# Altium schematic sheet Connector_Power.SchDoc
size A4; PageSetup: Record=PageOptions|CenterHorizontal=True|CenterVertical=True|PrintScale=1.00|XCorrection=1.00|YCorrection=1.00|PrintKind=1|BorderSize=5000000|LeftOffset=0|BottomOffset=0|Orientation=2|PaperLength=1000|PaperWidth=1000|Scale=100|PaperSource=7|PrintQuality=-3|MediaType=1|DitherType=10|PrintScaleMode=1|PaperKind=A4|PaperIndex=9
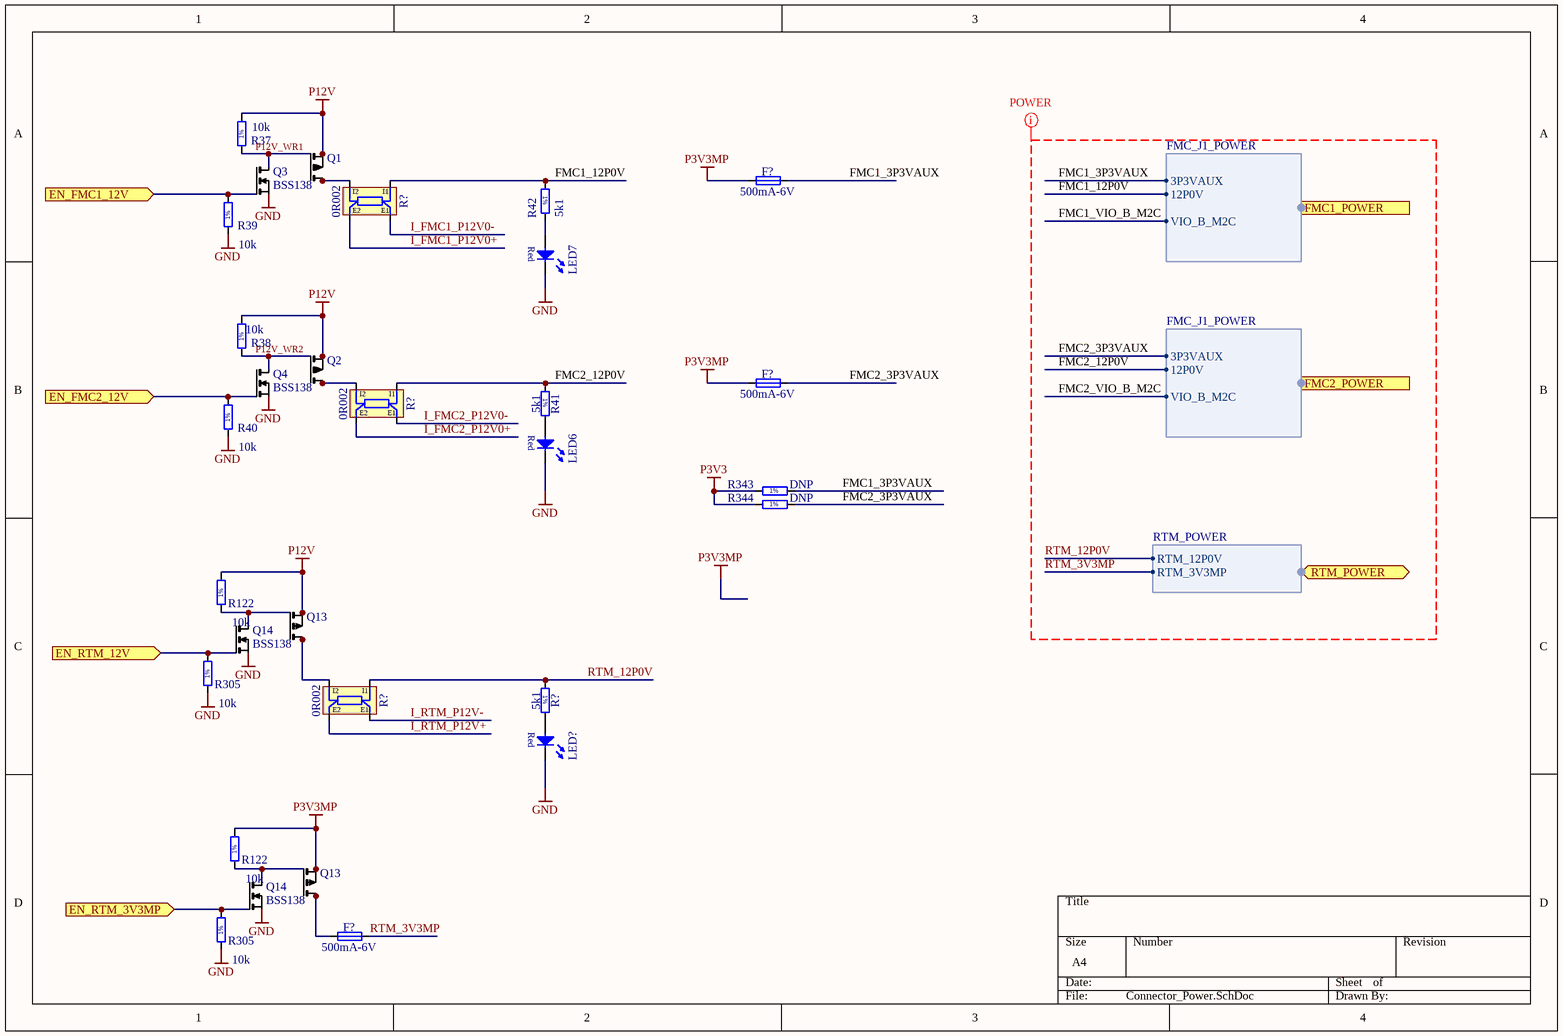
[diagram p0: Connector_Power.SchDoc]

## Parts
(Parts that share a designator on the sheet are numbered #1, #2 ... from top to bottom, then left to right.)
F?#1  500mA-6V  [FUSR_BOURNS_MF-PSMF050]
F?#2  500mA-6V  [FUSR_BOURNS_MF-PSMF050]
F?#3  500mA-6V  [FUSR_BOURNS_MF-PSMF050]
LED6  Red  [LED_AVAGO_HSMC-C150]  (value not drawn)
LED7  Red  [LED_AVAGO_HSMC-C150]  (value not drawn)
LED?  Red  [LED_AVAGO_HSMC-C150]  (value not drawn)
Q1  IRF9317PBF  or IRF9310PbF  [so-8]  (value not drawn)
Q2  IRF9317PBF  or IRF9310PbF  [so-8]  (value not drawn)
Q3  BSS138  [SOT95P251X112-3N]
Q4  BSS138  [SOT95P251X112-3N]
Q13#1  IRF9317PBF  or IRF9310PbF  [so-8]  (value not drawn)
Q13#2  IRF9317PBF  or IRF9310PbF  [so-8]  (value not drawn)
Q14#1  BSS138  [SOT95P251X112-3N]
Q14#2  BSS138  [SOT95P251X112-3N]
R37  10k  [RESC1005X40N]
R38  10k  [RESC1005X40N]
R39  10k  [RESC1005X40N]
R40  10k  [RESC1005X40N]
R41  5k1  [RESC1608X55N]
R42  5k1  [RESC1608X55N]
R122#1  10k  [RESC1005X40N]
R122#2  10k  [RESC1005X40N]
R305#1  10k  [RESC1005X40N]
R305#2  10k  [RESC1005X40N]
R343  DNP  [RESC1005X40N]
R344  DNP  [RESC1005X40N]
R?#1  0R002  [RES_VISHAY_WSL3637_0R002-0R01]
R?#2  0R002  [RES_VISHAY_WSL3637_0R002-0R01]
R?#3  5k1  [RESC1608X55N]
R?#4  0R002  [RES_VISHAY_WSL3637_0R002-0R01]

## Ports
EN_FMC1_12V (in), EN_FMC2_12V (in), EN_RTM_3V3MP (in), EN_RTM_12V (in), FMC1_POWER (harness FMC_J1_POWER), FMC2_POWER (harness FMC_J1_POWER), RTM_POWER (harness RTM_POWER)

## Harnesses
FMC_J1_POWER: 3P3VAUX, 12P0V, VIO_B_M2C
RTM_POWER: RTM_12P0V, RTM_3V3MP

## Nets
GND: LED6.1(C) LED7.1(C) LED?.1(C) Q3.2(S) Q4.2(S) Q14#1.2(S) Q14#2.2(S) R39.1 R40.1 R305#1.1 R305#2.1
P3V3: R343.1 R344.1
P3V3MP: F?#1.1 F?#2.1 Q13#2.1(S1) Q13#2.2(S1) Q13#2.3(S1) R122#2.2
P12V: Q1.1(S1) Q1.2(S1) Q1.3(S1) Q2.1(S1) Q2.2(S1) Q2.3(S1) Q13#1.1(S1) Q13#1.2(S1) Q13#1.3(S1) R37.2 R38.2 R122#1.2
EN_FMC1_12V: Q3.1(G) R39.2 ; port EN_FMC1_12V
EN_FMC2_12V: Q4.1(G) R40.2 ; port EN_FMC2_12V
EN_RTM_3V3MP: Q14#2.1(G) R305#2.2 ; port EN_RTM_3V3MP
EN_RTM_12V: Q14#1.1(G) R305#1.2 ; port EN_RTM_12V
FMC1_3P3VAUX: F?#1.2 R343.2 ; port FMC1_POWER.3P3VAUX
FMC1_12P0V: R42.1 R?#1.I1 ; port FMC1_POWER.12P0V
FMC1_VIO_B_M2C: port FMC1_POWER.VIO_B_M2C
FMC2_3P3VAUX: F?#2.2 R344.2 ; port FMC2_POWER.3P3VAUX
FMC2_12P0V: R41.1 R?#2.I1 ; port FMC2_POWER.12P0V
FMC2_VIO_B_M2C: port FMC2_POWER.VIO_B_M2C
I_FMC1_P12V0+: R?#1.E2
I_FMC1_P12V0-: R?#1.E1
I_FMC2_P12V0+: R?#2.E2
I_FMC2_P12V0-: R?#2.E1
I_RTM_P12V+: R?#4.E2
I_RTM_P12V-: R?#4.E1
P12V_WR1: Q1.4(G1) Q3.3(D) R37.1
P12V_WR2: Q2.4(G1) Q4.3(D) R38.1
RTM_3V3MP: F?#3.2 ; port RTM_POWER.RTM_3V3MP
RTM_12P0V: R?#3.1 R?#4.I1 ; port RTM_POWER.RTM_12P0V
NetF?#3_1: F?#3.1 Q13#2.5(D1) Q13#2.6(D1) Q13#2.7(D1) Q13#2.8(D1)
NetLED6_2: LED6.2(A) R41.2
NetLED7_2: LED7.2(A) R42.2
NetLED?_2: LED?.2(A) R?#3.2
NetQ1_5: Q1.5(D1) Q1.6(D1) Q1.7(D1) Q1.8(D1) R?#1.I2
NetQ2_5: Q2.5(D1) Q2.6(D1) Q2.7(D1) Q2.8(D1) R?#2.I2
NetQ13#1_4: Q13#1.4(G1) Q14#1.3(D) R122#1.1
NetQ13#1_5: Q13#1.5(D1) Q13#1.6(D1) Q13#1.7(D1) Q13#1.8(D1) R?#4.I2
NetQ13#2_4: Q13#2.4(G1) Q14#2.3(D) R122#2.1

## Layout directives
net class POWER: FMC1_3P3VAUX, FMC1_12P0V, FMC1_VIO_B_M2C, FMC2_3P3VAUX, FMC2_12P0V, FMC2_VIO_B_M2C, RTM_3V3MP, RTM_12P0V

## Notes on the sheet
- (in symbol R0402_0R_JUMPER) 1%
- (in symbol R0402_10K_1%_0.0625W_100PPM) 1%
- (in symbol R0603_5K1_1%_0.1W_100PPM) 1%

## Library data of the parts
F?#1-F?#3 = FUSR_BOURNS_MF-PSMF050X-2: Fuse; Part Description: PTC Resettable Fuse; Manufacturer: BOURNS; PressFit: No; Part Number: FUSR_BOURNS_MF-PSMF050X-2; Component Kind: Standard; Component Type: Standard; Pin Count: 2; PackageDescription: PTC Resettable Fuse, MF-PSMS Series, Height 0.48mm; Family: Fuses Resettable; Mounted: Yes; Socket: No; SMD: Yes; Sense: No; Value: 500mA-6V; Manufacturer Part Number: MF-PSMF050X-2; ComponentHeight: 0.48mm; HelpURL: \\cern.ch\dfs\Applications\Altium\Datasheets\FUSR_BOURNS_MF-PSMF.pdf; Author: CERN DEM MR; CreateDate: 02/12/2015; LatestRevisionDate: 02/12/2015
LED6 LED7 LED? = LED_AVAGO_HSMC-C150: LED Red 1C 2A; Part Description: Surface Mount Red LED (1206 Case); Manufacturer: AVAGO TECHNOLOGIES; PressFit: No; Bonding: No; Part Number: LED_AVAGO_HSMC-C150; Component Kind: Standard; Component Type: Standard; Color: Red; PackageDescription: Red Chip LED, 2-Leads, Body 3.2 x1.6mm, IPC Medium Density; Manufacturer Part Number: HSMC-C150; Pin Count: 2; Case: 1206; Mounted: Yes; Socket: No; SMD: Yes; Sense: No; ComponentHeight: 1.2mm; HelpURL: \\cern.ch\dfs\Applications\Altium\Datasheets\LED_AVAGO_HSMC-C150.pdf; Author: CERN DEM JLC; CreateDate: 18/06/2013; LatestRevisionDate: 18/06/2013
Q1 Q2 Q13#1 Q13#2 = Q_IRF9310: PMOS 30V, 4.6mR, 20A, 2.5W
Q3 Q4 Q14#1 Q14#2 = Q_BSS138
R37-R40 R122#1 R122#2 R305#1 R305#2 = R0402_10K_1%_0.0625W_100PPM: Resistor - 1%; Part Description: General Purpose Thick Film Chip Resistor; Manufacturer: GENERIC; Manufacturer1 Part Number: 232270671003L; TC: ±100ppm/°C; Table: Resistors SMD; Part Number: R0402_10K_1%_0.0625W_100PPM; Component Kind: Standard; Component Type: Standard; Pin Count: 2; Value: 10k; Status: Not recommended; Power: 0.0625W; Tolerance: ±1%; Manufacturer Part Number: R0402_10K_1%_0.0625W_100PPM; Case: 0402; Mounted: Yes; Socket: No; SMD: Yes; Manufacturer1 Example: YAGEO PHYCOMP; Manufacturer1 ComponentHeight: 0.4mm; HelpURL: \\cern.ch\dfs\Applications\Altium\Datasheets\R0402_Phycomp_RC0402.pdf; Author: CERN DEM JLC; CreateDate: 2007-12-03; LatestRevisionDate: 2012-10-17
R41 R42 R?#3 = R0603_5K1_1%_0.1W_100PPM: Resistor - 1%; Part Description: General Purpose Thick Film Chip Resistor; Manufacturer: GENERIC; Manufacturer1 Part Number: NRC06F5101TRF; Power: 0.1W; TC: ±100ppm/°C; Table: Resistors SMD; Part Number: R0603_5K1_1%_0.1W_100PPM; Component Kind: Standard; Component Type: Standard; Pin Count: 2; Value: 5k1; Status: Preferred; Tolerance: ±1%; Manufacturer Part Number: R0603_5K1_1%_0.1W_100PPM; Case: 0603; Mounted: Yes; Socket: No; SMD: Yes; Manufacturer1 Example: NIC COMPONENT; Manufacturer1 ComponentHeight: 0.55mm; HelpURL: \\cern.ch\dfs\Applications\Altium\Datasheets\R0603_NIC_NRC.pdf; Author: CERN DEM JLC; CreateDate: 2007-12-03; LatestRevisionDate: 2008-03-13
R343 R344 = R0402_0R_JUMPER: Resistor - 1%; Part Description: 1A (0.05R Max DC Resistance) Zero Ohm Jumper; Manufacturer: GENERIC; Manufacturer1 Part Number: 232270591001L; Value: 0; Table: Resistors SMD; Part Number: R0402_0R_JUMPER; Component Kind: Standard; Component Type: Standard; Pin Count: 2; Status: Not recommended; Manufacturer Part Number: R0402_0R_JUMPER; Case: 0402; Mounted: Yes; Socket: No; SMD: Yes; Manufacturer1 Example: YAGEO PHYCOMP; Manufacturer1 ComponentHeight: 0.4mm; HelpURL: \\cern.ch\dfs\Applications\Altium\Datasheets\R0402_Phycomp_RC0402.pdf; Author: CERN DEM JLC; CreateDate: 2007-12-03; LatestRevisionDate: 2012-10-17
R?#1 R?#2 R?#4 = R3637_0R002_1%_3W_50PPM_VISHAY_WSL3637: Power and Current Sensing Resistor; Part Description: Power Metal Strip® Resistor, Low Value; Manufacturer: VISHAY DALE; Manufacturer Part Number: WSL36372L000FEA; Power: 3W; TC: ±75ppm/°C; Tolerance: ±1%; Part Number: R3637_0R002_1%_3W_50PPM_VISHAY_WSL3637; Component Kind: Standard; Component Type: Standard; Pin Count: 2; Value: 0R002; Status: None; Case: 3637; Mounted: Yes; Sense: No; Socket: No; SMD: Yes; ComponentHeight: 0.89mm; HelpURL: \\cern.ch\dfs\Applications\Altium\Datasheets\R3637_VISHAY_WSL3637.pdf; Author: CERN DEM MR; CreateDate: 02/06/2016; LatestRevisionDate: 02/06/2016